# EAGLE design MADcomboV2.2 (EAGLE 9.5.1)
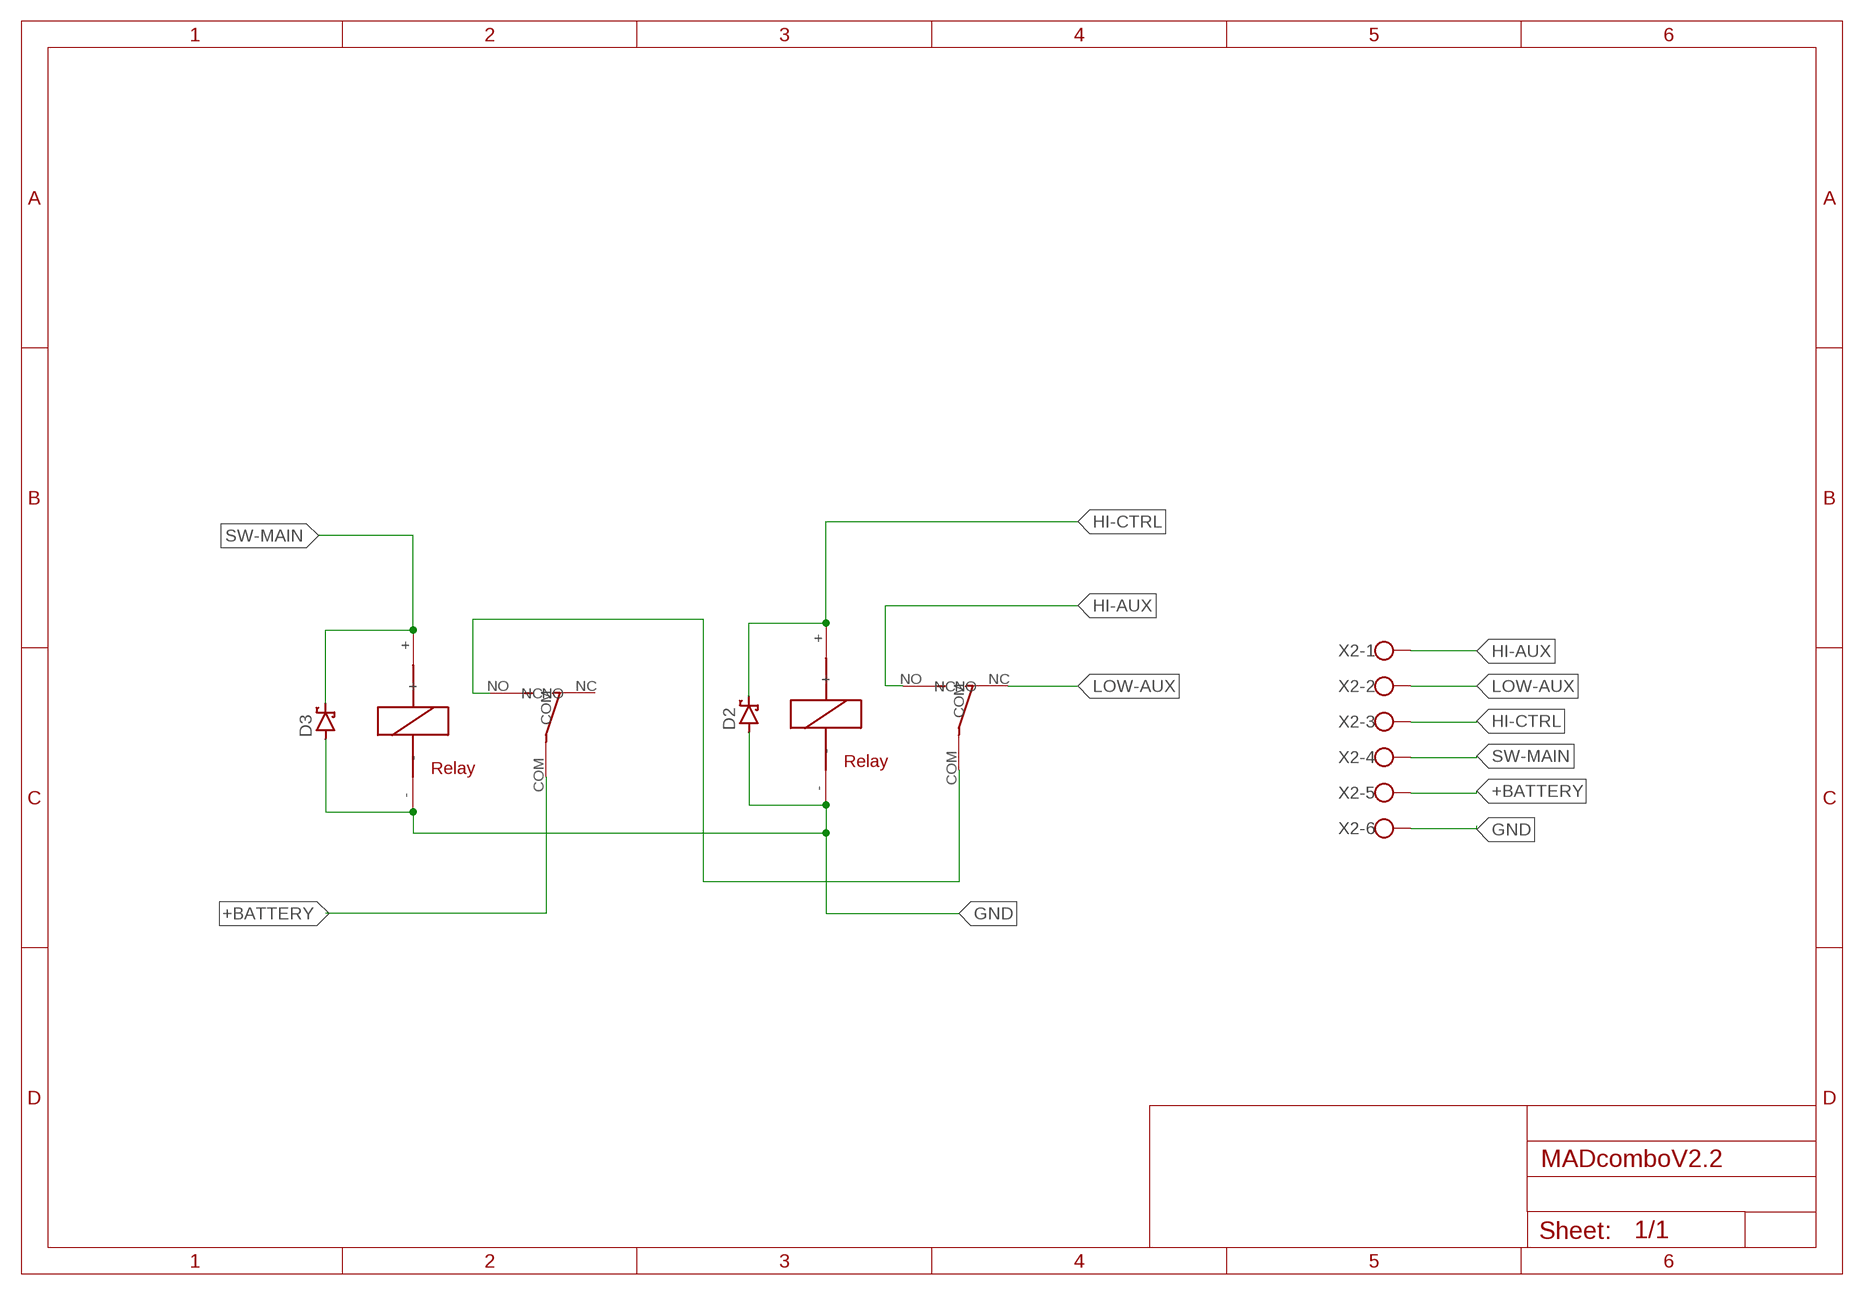
[diagram p0: schematic, sheet 1]

## Parts
D2  SCHOTTKY-DIODESMD  [SMB]
D3  SCHOTTKY-DIODESMD  [SMB]
U$3  RELAY_MINI_SONGLE  [RELAY_MINI_SONGLE]
U$4  RELAY_MINI_SONGLE  [RELAY_MINI_SONGLE]
X2  W237-136  [W237-136]

## Nets
+BATTERY: U$3.COM X2.5
GND: D2.A D3.A U$3.- U$4.- X2.6
HI-AUX: U$4.NO X2.1
HI-CTRL: D2.C U$4.+ X2.3
LOW-AUX: U$4.NC X2.2
N$3: U$3.NO U$4.COM
SW-MAIN: D3.C U$3.+ X2.4
Unconnected: U$3.NC

## Library data of the parts
D2 D3 = diode:SCHOTTKY-DIODE: Schottky Diode
U$3 U$4 = relay_mini_Songle:RELAY_MINI_SONGLE
X2 = con-wago-500:W237-136: WAGO SCREW CLAMP; MPN: 237-136; OC_FARNELL: unknown; OC_NEWARK: 84K9151

## Board
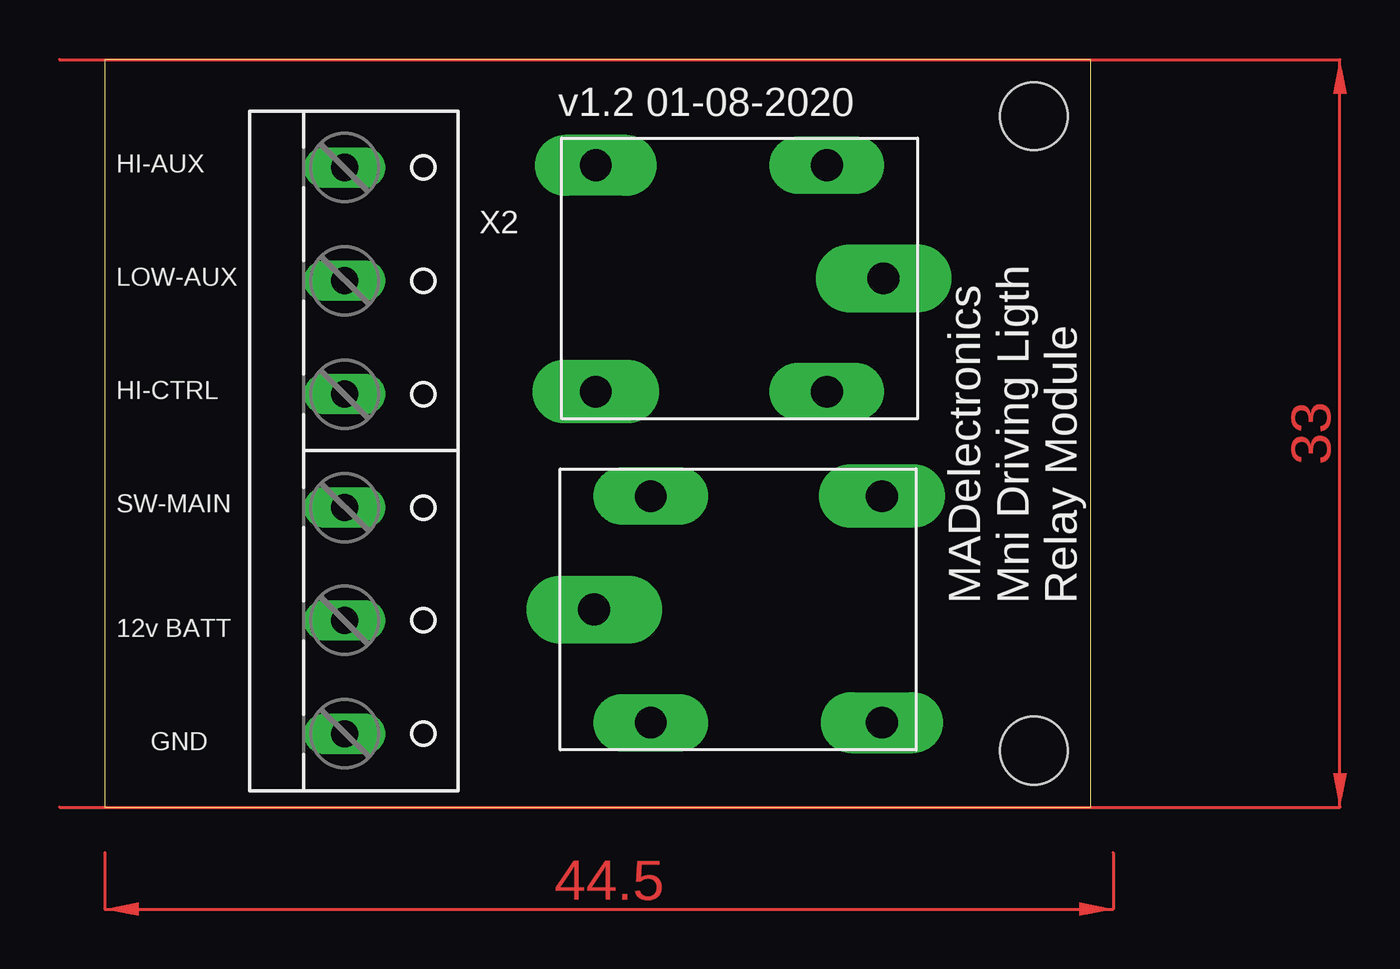
[diagram p1: board, top side]
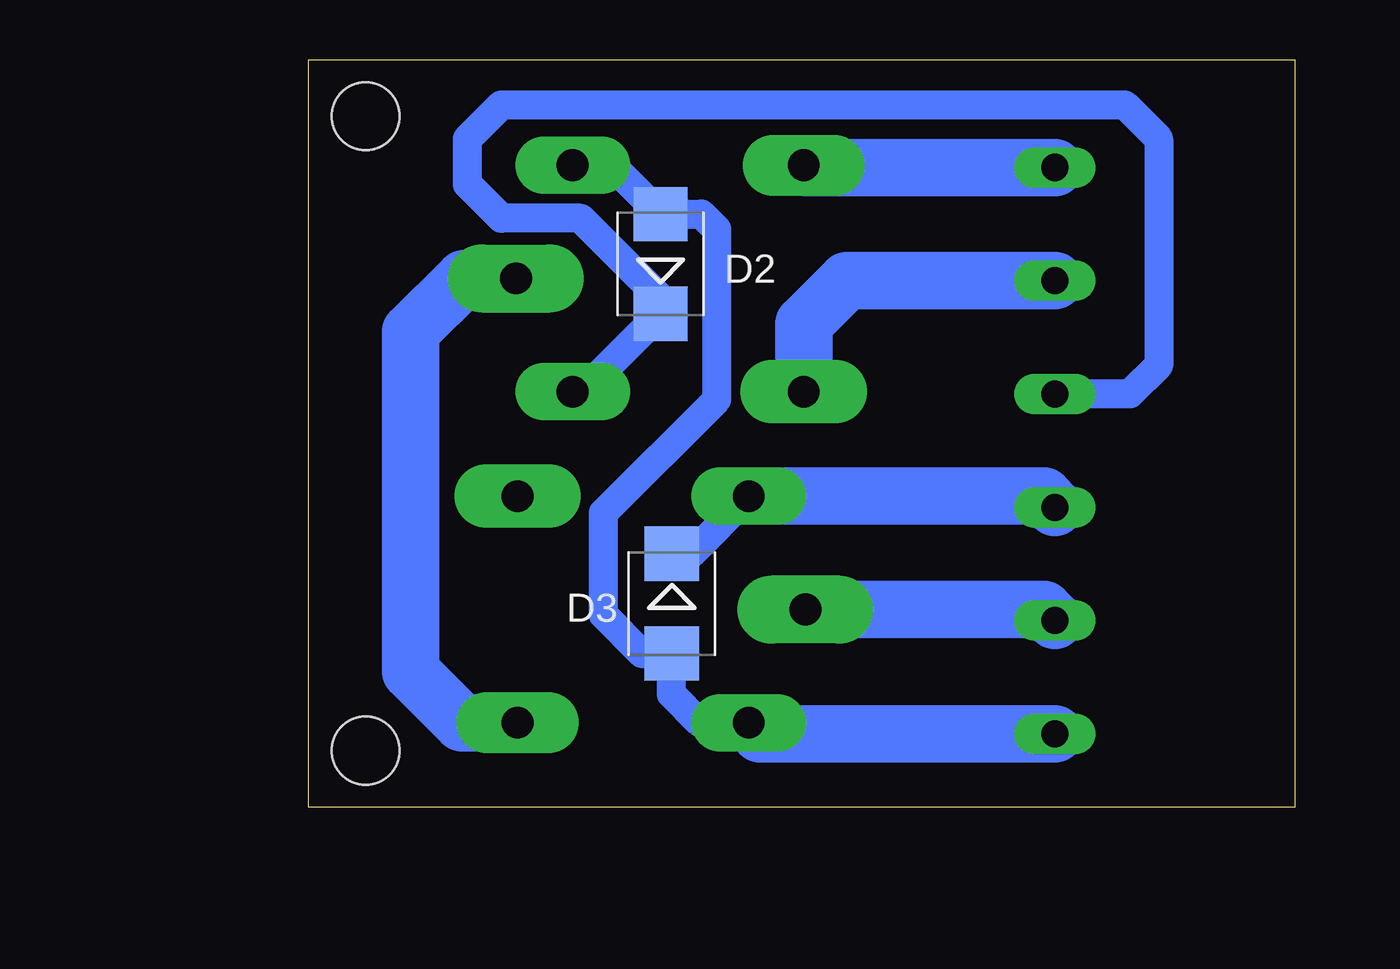
[diagram p2: board, bottom side, seen from below]

Size 43.5 x 33 mm. Coordinates in mm from the lower left corner, seen from the top.
Outline: 0,0 43.5,0 43.5,33 0,33 0,0
Copper layers (1*16): Top 0.035mm / dielectric 1.5mm / Bottom 0.035mm
Design rules "default": minimum track width 6mil, minimum drill 0.35mm, track to track 6mil, track to pad 6mil, pad to pad 6mil, via to via 6mil, smd to smd 6mil, copper to edge 40mil, drill to drill 6mil, minimum pad ring 10mil, minimum via ring 8mil, stop-mask expansion 4mil, vias tented up to drill 0mil, thermal gap 10mil
Holes 3 mm at 41,2.5 41,30.5

### Footprints (pad centres in the part's own frame; a part is rotated, then mirrored left to right if it is on the bottom)
SMB = smd 2.4 x 2.4: A 2.2,0; C -2.2,0
RELAY_MINI_SONGLE = drill 1.4 pad 2.54 long: + -4,8.1; - -4,-1.9 | drill 1.4 pad 3 long: COM -6.5,3.1 | drill 1.4 pad 2.8 long: NC 6.2,8.1 | drill 1.4 pad 2.7 long: NO 6.2,-1.9
W237-136 = drill 1.194 long: 1 -12.5,-1.27; 2 -7.5,-1.27; 3 -2.5,-1.27; 4 2.5,-1.27; 5 7.5,-1.27; 6 12.5,-1.27

### Placement (x,y rotation side)
D2  27.98,23.98 90 bottom
D3  27.48,8.99 270 bottom
U$2  [MADTRONICS_LOGO_6MM]  0.5,2 90 bottom
U$3  28.09,5.63 0 top
U$4  27.86,26.44 180 top
X2  11.85,15.74 270 top

### Tracks (layer width: path | path; a pad name or v marks a point on that pad's centre or on a via)
+BATTERY
  Bottom 2.54: U$3.COM 11.07,8.73 X2.5
GND
  Bottom 1.27: U$4.- 30.14,28.34 D2.A 26.18,26.18 25.5,25.5 25.5,18 30.5,13 30.5,8.5 28.79,6.79 D3.A 27.5,6.77 27.5,5 26.23,3.73 U$3.-
  Bottom 2.54: U$3.- 23.6,3.24 X2.6
HI-AUX
  Bottom 2.54: U$4.NO 21.56,28.24 X2.1
HI-CTRL
  Bottom 1.27: X2.3 7.26,18.24 6,19.5 6,29.5 7.5,31 35,31 36.5,29.5 36.5,27.5 35,26 31.5,26 27.98,22.48 D2.C 31.42,18.34 U$4.+
LOW-AUX
  Bottom 2.54: U$4.NC 21.66,21.34 19.76,23.24 X2.2
N$3
  Bottom 2.54: U$4.COM 36.66,23.34 39,21 39,6 36.73,3.73 U$3.NO
SW-MAIN
  Bottom 1.27: U$3.+ 26.63,11.19 D3.C
  Bottom 2.54: U$3.+ 11.07,13.73 X2.4
(copper drawn outside any net)
  shapes: Top area x2

### Text on the board
tNames: v1.2 01-08-2020 | HI-AUX | LOW-AUX | HI-CTRL | SW-MAIN | MADelectronics / Mni Driving Ligth / Relay Module | 12v BATT | GND